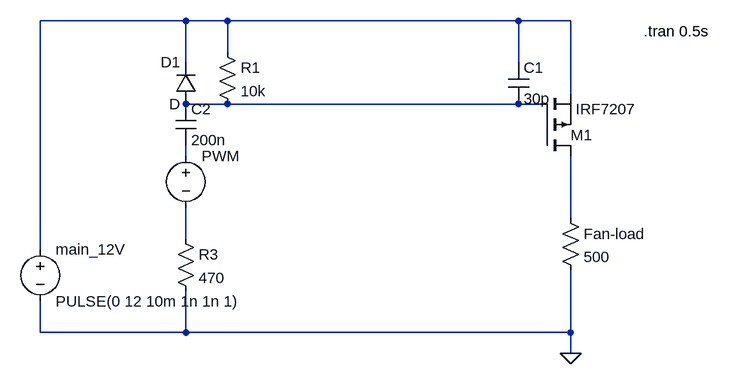
[diagram p0: schematic simple-driver1.asc]
simple-driver1.asc, the LTspice schematic file:
Version 4
SHEET 1 880 680
WIRE -64 -240 -288 -240
WIRE 0 -240 -64 -240
WIRE 448 -240 0 -240
WIRE 528 -240 448 -240
WIRE 0 -192 0 -240
WIRE -64 -176 -64 -240
WIRE 448 -176 448 -240
WIRE 528 -128 528 -240
WIRE 0 -112 -64 -112
WIRE 448 -112 0 -112
WIRE 480 -112 448 -112
WIRE -64 -32 -64 -48
WIRE 528 64 528 -32
WIRE -64 96 -64 48
WIRE -288 112 -288 -240
WIRE -288 240 -288 192
WIRE -64 240 -64 176
WIRE -64 240 -288 240
WIRE 528 240 528 144
WIRE 528 240 -64 240
WIRE 528 272 528 240
FLAG 528 272 0
SYMBOL voltage -288 96 R0
WINDOW 123 0 0 Left 0
WINDOW 39 0 0 Left 0
SYMATTR InstName main_12V
SYMATTR Value PULSE(0 12 10m 1n 1n 1)
SYMBOL pmos 480 -32 M180
WINDOW 0 48 32 Left 2
SYMATTR InstName M1
SYMATTR Value IRF7207
SYMBOL diode -48 -112 R180
WINDOW 0 24 64 Left 2
WINDOW 3 24 0 Left 2
SYMATTR InstName D1
SYMBOL res -16 -208 R0
SYMATTR InstName R1
SYMATTR Value 10k
SYMBOL cap 432 -176 R0
SYMATTR InstName C1
SYMATTR Value 30p
SYMBOL voltage -64 -48 R0
WINDOW 3 24 96 Invisible 2
WINDOW 123 0 0 Left 0
WINDOW 39 24 124 Left 2
SYMATTR InstName PWM
SYMATTR Value PULSE(0 5 50m 5n 15n 400µ 1m 1000)
SYMBOL cap -80 -112 R0
SYMATTR InstName C2
SYMATTR Value 200n
SYMATTR SpiceLine V=20
SYMBOL res 512 48 R0
SYMATTR InstName Fan-load
SYMATTR Value 500
SYMBOL res -80 80 R0
SYMATTR InstName R3
SYMATTR Value 470
TEXT 640 -224 Left 2 !.tran 0.5s

The netlist it stands for:
* simple-driver1.asc
V§main_12V N001 0 PULSE(0 12 10m 1n 1n 1)
M1 N004 N002 N001 N001 IRF7207
D1 N002 N001 D
R1 N001 N002 10k
C1 N001 N002 30p
V§PWM N003 N005 PULSE(0 5 50m 5n 15n 400µ 1m 1000)
C2 N002 N003 200n V=20
R§Fan-load N004 0 500
R3 N005 0 470
.model D D
.lib standard.dio
.model NMOS NMOS
.model PMOS PMOS
.lib standard.mos
.tran 0.5s
.backanno
.end